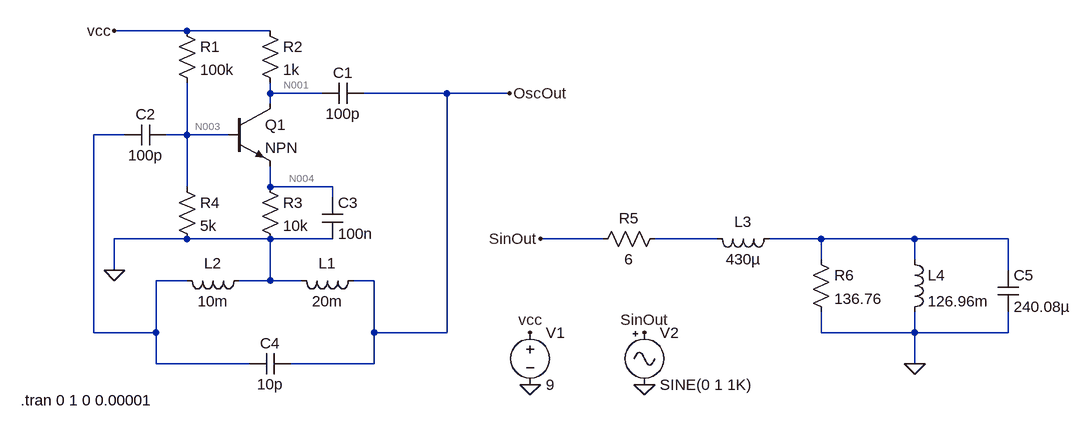
[diagram p0: schematic WtfPart1.asc]
WtfPart1.asc, the LTspice schematic file:
Version 4
SHEET 1 1676 680
WIRE 192 16 80 16
WIRE 320 16 192 16
WIRE 320 112 320 96
WIRE 400 112 320 112
WIRE 592 112 464 112
WIRE 688 112 592 112
WIRE 320 128 320 112
WIRE 96 176 48 176
WIRE 192 176 192 96
WIRE 192 176 160 176
WIRE 256 176 192 176
WIRE 192 256 192 176
WIRE 320 256 320 224
WIRE 416 256 320 256
WIRE 416 272 416 256
WIRE 192 336 80 336
WIRE 320 336 192 336
WIRE 416 336 320 336
WIRE 832 336 736 336
WIRE 1008 336 912 336
WIRE 1168 336 1088 336
WIRE 1312 336 1168 336
WIRE 1456 336 1312 336
WIRE 1168 368 1168 336
WIRE 1312 368 1312 336
WIRE 80 384 80 336
WIRE 1456 384 1456 336
WIRE 192 400 144 400
WIRE 320 400 320 336
WIRE 320 400 272 400
WIRE 368 400 320 400
WIRE 480 400 448 400
WIRE 48 480 48 176
WIRE 144 480 144 400
WIRE 144 480 48 480
WIRE 480 480 480 400
WIRE 592 480 592 112
WIRE 592 480 480 480
WIRE 1168 480 1168 448
WIRE 1312 480 1312 448
WIRE 1312 480 1168 480
WIRE 1456 480 1456 448
WIRE 1456 480 1312 480
WIRE 144 528 144 480
WIRE 288 528 144 528
WIRE 480 528 480 480
WIRE 480 528 352 528
WIRE 1312 528 1312 480
FLAG 720 560 0
FLAG 720 480 vcc
FLAG 80 16 vcc
FLAG 80 384 0
FLAG 688 112 OscOut
FLAG 736 336 SinOut
FLAG 1312 528 0
FLAG 896 560 0
FLAG 896 480 SinOut
SYMBOL res 176 0 R0
SYMATTR InstName R1
SYMATTR Value 100k
SYMBOL res 304 0 R0
SYMATTR InstName R2
SYMATTR Value 1k
SYMBOL npn 256 128 R0
SYMATTR InstName Q1
SYMBOL cap 464 96 R90
WINDOW 0 0 32 VBottom 2
WINDOW 3 32 32 VTop 2
SYMATTR InstName C1
SYMATTR Value 100p
SYMBOL cap 160 160 R90
WINDOW 0 0 32 VBottom 2
WINDOW 3 32 32 VTop 2
SYMATTR InstName C2
SYMATTR Value 100p
SYMBOL res 304 240 R0
SYMATTR InstName R3
SYMATTR Value 10k
SYMBOL res 176 240 R0
SYMATTR InstName R4
SYMATTR Value 5k
SYMBOL cap 400 272 R0
SYMATTR InstName C3
SYMATTR Value 100n
SYMBOL ind 464 384 R90
WINDOW 0 5 56 VBottom 2
WINDOW 3 32 56 VTop 2
SYMATTR InstName L1
SYMATTR Value 20m
SYMBOL ind 288 384 R90
WINDOW 0 5 56 VBottom 2
WINDOW 3 32 56 VTop 2
SYMATTR InstName L2
SYMATTR Value 10m
SYMBOL cap 352 512 R90
WINDOW 0 0 32 VBottom 2
WINDOW 3 32 32 VTop 2
SYMATTR InstName C4
SYMATTR Value 10p
SYMBOL res 928 320 R90
WINDOW 0 0 56 VBottom 2
WINDOW 3 32 56 VTop 2
SYMATTR InstName R5
SYMATTR Value 6
SYMBOL ind 1104 320 R90
WINDOW 0 5 56 VBottom 2
WINDOW 3 32 56 VTop 2
SYMATTR InstName L3
SYMATTR Value 430µ
SYMBOL res 1152 352 R0
SYMATTR InstName R6
SYMATTR Value 136.76
SYMBOL ind 1296 352 R0
SYMATTR InstName L4
SYMATTR Value 126.96m
SYMBOL cap 1440 384 R0
SYMATTR InstName C5
SYMATTR Value 240.08µ
SYMBOL voltage 720 464 R0
WINDOW 123 0 0 Left 0
WINDOW 39 0 0 Left 0
SYMATTR InstName V1
SYMATTR Value 9
SYMBOL Misc\\signal 896 464 R0
SYMATTR InstName V2
TEXT -64 584 Left 2 !.tran 0 1 0 0.00001

The netlist it stands for:
* WtfPart1.asc
R1 vcc N003 100k
R2 vcc N001 1k
Q1 N001 N003 N004 0 NPN
C1 OscOut N001 100p
C2 N003 N002 100p
R3 N004 0 10k
R4 N003 0 5k
C3 N004 0 100n
L1 OscOut 0 20m
L2 0 N002 10m
C4 OscOut N002 10p
R5 N005 SinOut 6
L3 N006 N005 430µ
R6 N006 0 136.76
L4 N006 0 126.96m
C5 N006 0 240.08µ
V1 vcc 0 9
V2 SinOut 0 SINE(0 1 1K)
.model NPN NPN
.model PNP PNP
.lib standard.bjt
.tran 0 1 0 0.00001
.backanno
.end

* Results of the author's LTspice run, read from the files saved beside the schematic
* Operating Point, zero values left out:
*   V(vcc) = 9 V
*   V(n003) = 428.6 mV
*   V(n001) = 9 V
*   V(n004) = 15.86 µV
*   Ic(Q1) = 1.578 nA
*   Ib(Q1) = 7.554 pA
*   Ie(Q1) = -1.586 nA
*   I(R1) = 85.71 µA
*   I(R2) = 1.578 nA
*   I(R3) = 1.586 nA
*   I(R4) = 85.71 µA
*   I(V1) = -85.72 µA